# EasyEDA Pro project ProPrj_FurModularity 2_2025-12-27.epro, board PCB2_4
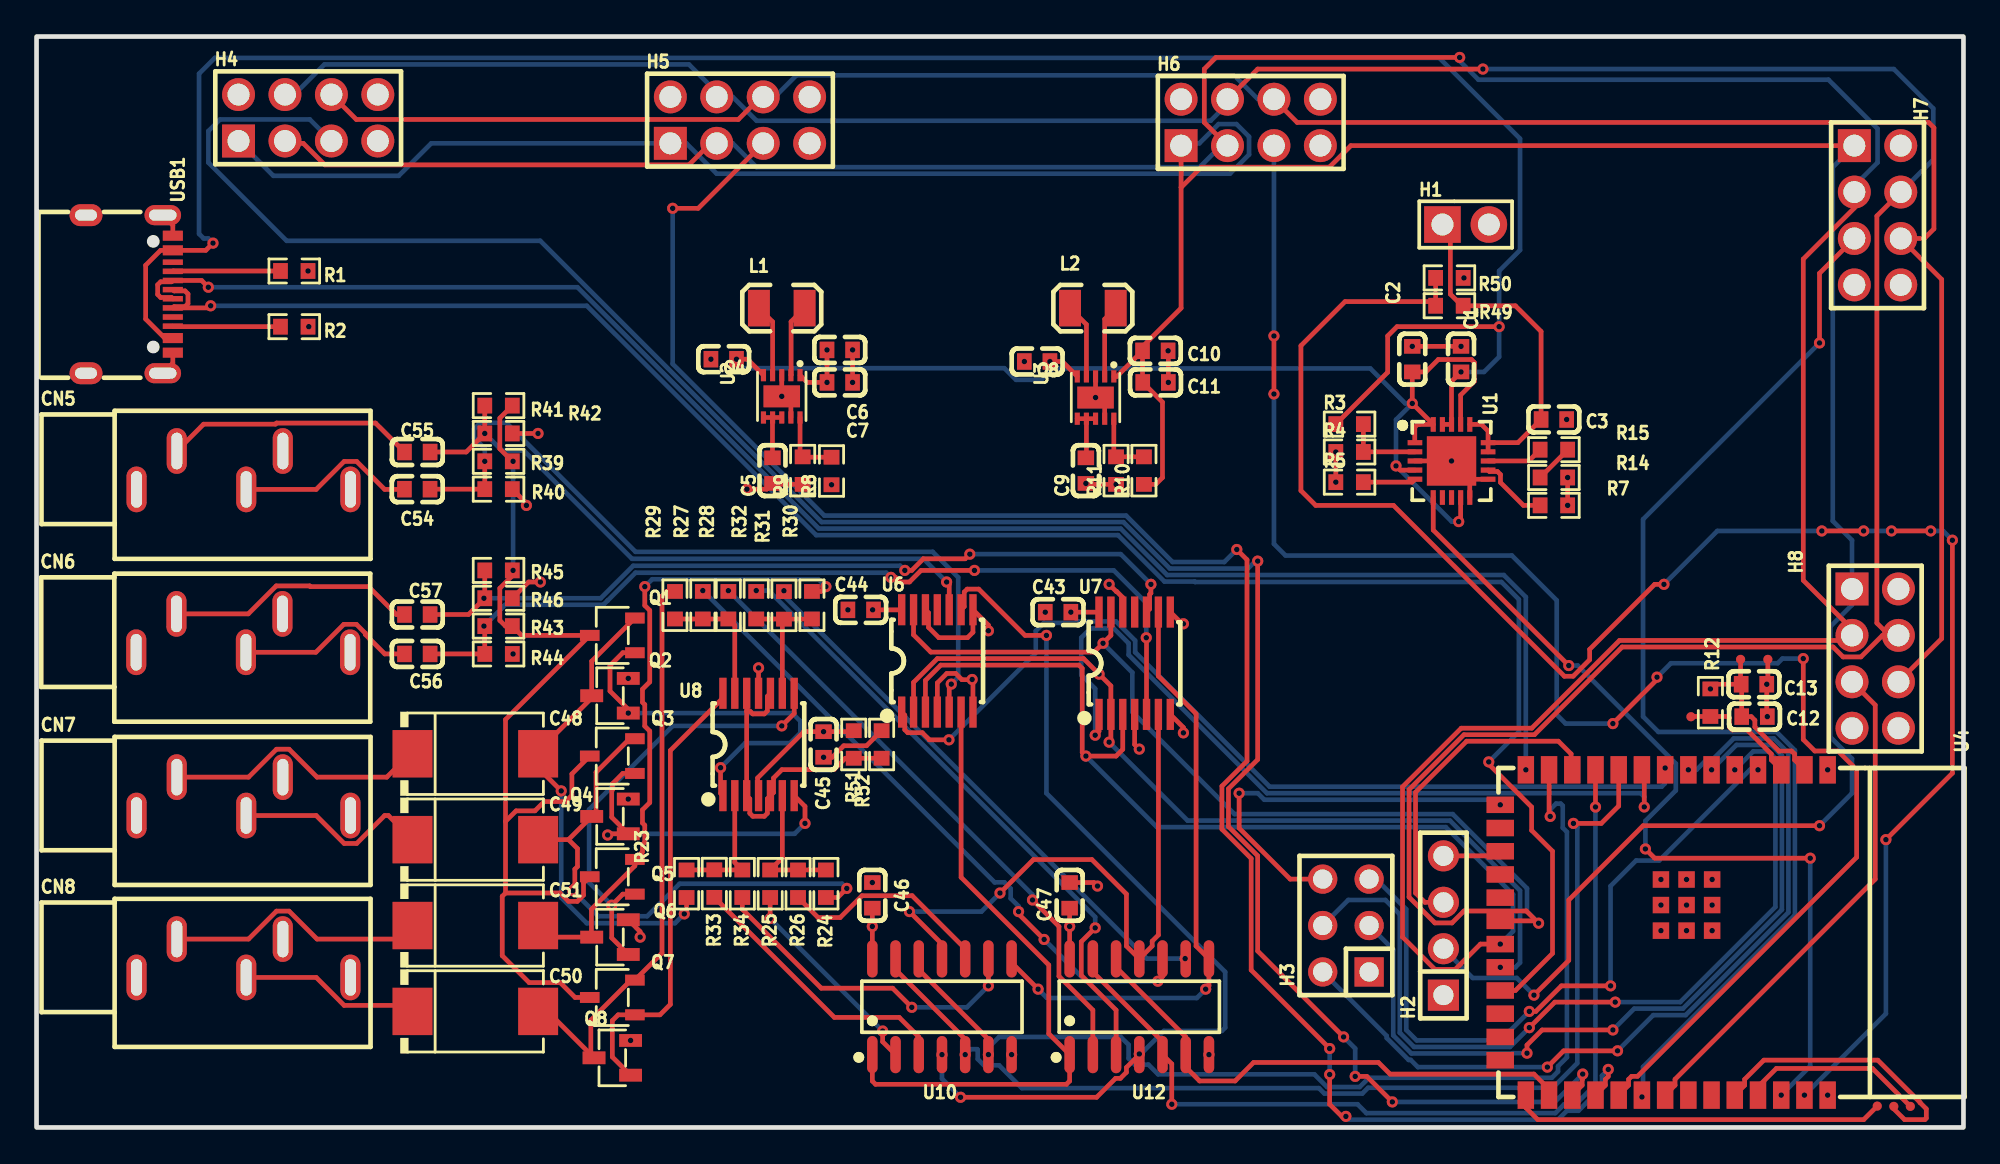
[diagram p7: board, top side]
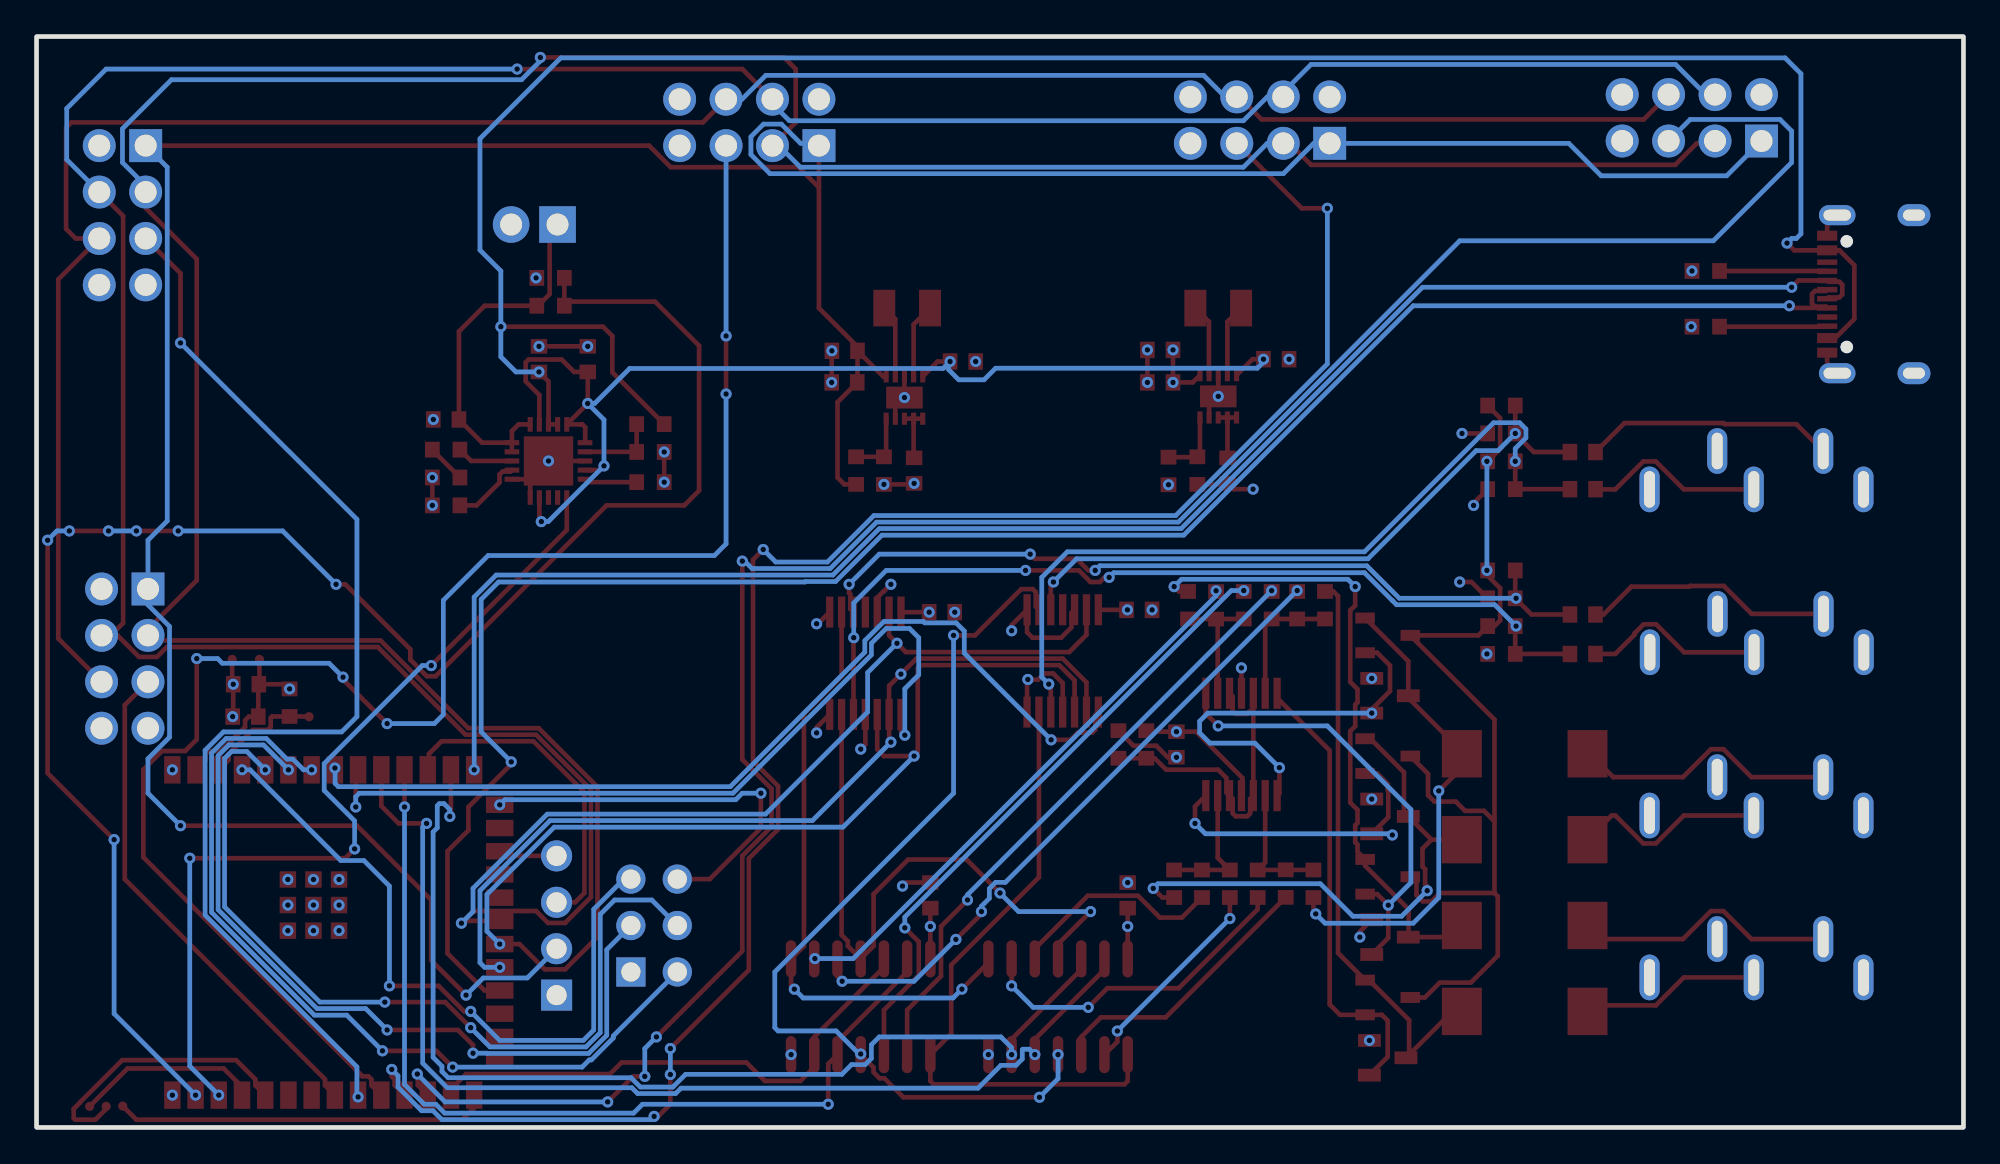
[diagram p8: board, bottom side, seen from below]

Outline 105.41 x 59.69 mm; copper layers: Top Layer, Inner1, Inner2, Bottom Layer. Coordinates in mm from the lower left corner of the outline.
Outline path: rectangle 0,59.69 105.41,0
Stack: Top Layer 0.035mm Outer layer thickness 1oz / Dielectric1 0.2104mm 7628 RC49% 8.6mil / Inner1 0.0152mm Inner layer thickness / Dielectric2 1.065mm 1.1mm H/HOZ Copper / Inner2 0.0152mm Inner layer thickness / Dielectric3 0.2104mm 7628 RC49% 8.6mil / Bottom Layer 0.035mm Outer layer thickness 1oz

## Design rules (mm)
template: JLCPCB Capability(Two Layers Board)
spacing copperThickness1oz (default): track to track 0.102, other pairs 0.152 to 0.3
spacing copperThickness2oz: track to track 0.203, other pairs 0.152 to 0.3
track width copperThickness1oz (default): min 0.127, default 0.254, max 2.54
track width copperThickness2oz: min 0.203, default 0.254, max 2.54
differential pair differentialPair (default): width min 0.127, default 0.254, max 2.54; gap min 0.152, default 0.152
via viaSize (default): diameter min 0.5, default 0.61, max 10; hole min 0.3, default 0.305, max 6.3

## Placement (name value [footprint] x y rotation side)
C1  10uF  [C0603]  77.93 42.04 270 top
C2  4.7uF  [C0603]  75.26 42.04 90 top
C3  4.7uF  [C0603]  83 38.74 0 top
C4  10uF  [C0603]  37.59 42.04 180 top
C5  100nF  [C0603]  40.26 35.94 270 top
C6  10uF  [C0603]  43.94 42.54 0 top
C7  10uF  [C0603]  43.94 40.77 0 top
C8  10uF  [C0603]  54.74 41.91 180 top
C9  100nF  [C0603]  57.4 35.94 270 top
C10  10uF  [C0603]  61.2 42.5 0 top
C11  10uF  [C0603]  61.21 40.77 0 top
C12  100nF  [C0603]  93.98 22.48 0 top
C13  100nF  [C0603]  93.95 24.25 0 top
C43  100nF  [C0603]  55.88 28.19 0 top
C44  100nF  [C0603]  45.09 28.32 0 top
C45  100nF  [C0603]  43.05 20.96 90 top
C46  10uF  [C0603]  45.72 12.7 90 top
C47  10uF  [C0603]  56.52 12.7 90 top
C48  470uF  [CAP-SMD_L7.3-W4.3-FD]  24 20.45 0 top
C49  470uF  [CAP-SMD_L7.3-W4.3-FD]  24 15.75 0 top
C50  470uF  [CAP-SMD_L7.3-W4.3-FD]  24 6.35 0 top
C51  470uF  [CAP-SMD_L7.3-W4.3-FD]  24 11.05 0 top
C54  10uF  [C0603]  20.83 34.93 180 top
C55  10uF  [C0603]  20.83 36.96 180 top
C56  10uF  [C0603]  20.83 25.91 180 top
C57  10uF  [C0603]  20.83 28.07 180 top
CN5  KH-PJ-325C  [AUDIO-TH_KH-PJ-325C]  11.32 35.96 0 top
CN6  KH-PJ-325C  [AUDIO-TH_KH-PJ-325C]  11.3 27.05 0 top
CN7  KH-PJ-325C  [AUDIO-TH_KH-PJ-325C]  11.32 18.12 0 top
CN8  KH-PJ-325C  [AUDIO-TH_KH-PJ-325C]  11.32 9.26 0 top
H1  PZ254V-11-02P  [HDR-TH_2P-P2.54-V-M]  78.18 49.41 0 top
H2  PZ254V-11-04P  [HDR-TH_4P-P2.54-V-M]  76.96 11.05 90 top
H3  2.54-2*3  [HDR-TH_6P-P2.54-V-R2-C3-S2.54_A2541WV-2X3P]  71.63 11.05 90 top
H4  A2541WV-2x4P  [HDR-TH_8P-P2.54-V-R2-C4-S2.54_A2541WV-2X4P]  14.86 55.25 0 top
H5  A2541WV-2x4P  [HDR-TH_8P-P2.54-V-R2-C4-S2.54_A2541WV-2X4P]  38.48 55.12 0 top
H6  A2541WV-2x4P  [HDR-TH_8P-P2.54-V-R2-C4-S2.54_A2541WV-2X4P]  66.42 54.99 0 top
H7  A2541WV-2x4P  [HDR-TH_8P-P2.54-V-R2-C4-S2.54_A2541WV-2X4P]  100.71 49.91 270 top
H8  A2541WV-2x4P  [HDR-TH_8P-P2.54-V-R2-C4-S2.54_A2541WV-2X4P]  100.58 25.65 270 top
L1  1.5uH  [L1207]  40.77 44.83 0 top
L2  1.5uH  [L1207]  57.78 44.83 0 top
Q1  MMBT2222A  [SOT-23-3_L2.9-W1.6-P1.90-LS2.8-BR]  31.5 26.92 0 top
Q2  MMBT2907A  [SOT-23-3_L2.9-W1.3-P1.90-LS2.4-BR]  31.37 23.62 0 top
Q3  MMBT2222A  [SOT-23-3_L2.9-W1.6-P1.90-LS2.8-BR]  31.5 20.32 0 top
Q4  MMBT2907A  [SOT-23-3_L2.9-W1.3-P1.90-LS2.4-BR]  31.37 17.02 0 top
Q5  MMBT2222A  [SOT-23-3_L2.9-W1.6-P1.90-LS2.8-BR]  31.5 13.72 0 top
Q6  MMBT2907A  [SOT-23-3_L2.9-W1.3-P1.90-LS2.4-BR]  31.37 10.41 0 top
Q7  MMBT2222A  [SOT-23-3_L2.9-W1.6-P1.90-LS2.8-BR]  31.5 7.11 0 top
Q8  MMBT2907A  [SOT-23-3_L2.9-W1.3-P1.90-LS2.4-BR]  31.5 3.81 0 top
R1  5.1kΩ  [R0603]  14.1 46.86 180 top
R2  5.1kΩ  [R0603]  14.1 43.82 180 top
R3  330kΩ  [R0603]  71.83 38.48 180 top
R4  110kΩ  [R0603]  71.83 36.96 0 top
R5  10kΩ  [R0603]  71.83 35.31 0 top
R7  100kΩ  [R0603]  83 34.04 180 top
R8  1.13MΩ  [R0603]  43.49 35.92 270 top
R9  200kΩ  [R0603]  41.91 35.94 90 top
R10  1.8MΩ  [R0603]  60.58 35.94 270 top
R11  200kΩ  [R0603]  59.05 35.94 90 top
R12  10kΩ  [R0603]  91.57 23.24 90 top
R14  1kΩ  [R0603]  83 35.56 180 top
R15  1kΩ  [R0603]  83 37.09 180 top
R23  1kΩ  [R0603]  35.56 13.34 270 top
R24  1kΩ  [R0603]  43.18 13.34 270 top
R25  1kΩ  [R0603]  40.13 13.34 90 top
R26  1kΩ  [R0603]  41.66 13.34 90 top
R27  1kΩ  [R0603]  36.45 28.58 270 top
R28  1kΩ  [R0603]  37.85 28.58 270 top
R29  1kΩ  [R0603]  34.92 28.58 90 top
R30  1kΩ  [R0603]  42.42 28.58 90 top
R31  1kΩ  [R0603]  40.89 28.57 270 top
R32  1kΩ  [R0603]  39.37 28.58 270 top
R33  1kΩ  [R0603]  37.08 13.34 90 top
R34  1kΩ  [R0603]  38.61 13.34 90 top
R39  10kΩ  [R0603]  25.27 36.45 0 top
R40  10kΩ  [R0603]  25.27 34.93 180 top
R41  10kΩ  [R0603]  25.27 39.5 0 top
R42  10kΩ  [R0603]  25.27 37.97 180 top
R43  10kΩ  [R0603]  25.27 27.43 0 top
R44  10kΩ  [R0603]  25.27 25.91 180 top
R45  10kΩ  [R0603]  25.27 30.48 0 top
R46  10kΩ  [R0603]  25.27 28.96 180 top
R49  1kΩ  [R0603]  77.29 44.96 0 top
R50  1kΩ  [R0603]  77.29 46.48 180 top
R51  1kΩ  [R0603]  44.7 20.96 90 top
R52  1kΩ  [R0603]  46.23 20.96 270 top
TP1  -  [Test-Point-0.5mm]  90.5 22.47 0 top
TP2  -  [Test-Point-0.5mm]  100.7 1.17 0 top
TP3  -  [Test-Point-0.5mm]  102.51 1.15 0 top
TP4  -  [Test-Point-0.5mm]  101.6 1.15 0 top
TP5  -  [Test-Point-0.5mm]  93.22 25.61 0 top
TP6  -  [Test-Point-0.5mm]  94.71 25.61 0 top
U1  MCP73871-2CAI/ML  [QFN-20_L4.0-W4.0-P0.50-BL-EP2.7]  77.41 36.47 270 top
U2  TPS63030DSKTG4  [SON-10_L2.5-W2.5-P0.50-TL-EP]  40.77 40 270 top
U3  TPS63030DSKTG4  [SON-10_L2.5-W2.5-P0.50-TL-EP]  57.93 39.94 270 top
U4  ESP32-S3-WROOM-1-N4  [WIFIM-SMD_ESP32-S3-WROOM-1-N8]  89.03 10.67 270 top
U6  MCP4261-103E/ST  [TSSOP-14_L5.0-W4.4-P0.65-LS6.4-BL]  49.28 25.53 0 top
U7  MCP4261-103E/ST  [TSSOP-14_L5.0-W4.4-P0.65-LS6.4-BL]  60.07 25.4 0 top
U8  LMV324IPWRE4  [TSSOP-14_L5.0-W4.4-P0.65-LS6.4-BL]  39.5 20.96 0 top
U10  74VHC4066M  [SOIC-14_L8.7-W3.9-P1.27-LS6.0-BL]  49.53 6.6 0 top
U12  74VHC4066M  [SOIC-14_L8.7-W3.9-P1.27-LS6.0-BL]  60.32 6.6 0 top
USB1  TYPE-C 16PIN 2MD(073)  [USB-C-SMD_TYPE-C-6PIN-2MD-073]  5.08 45.59 270 top

## Footprints (pads in the part's own frame, mm; a bottom-side part is the same pattern mirrored in y, then rotated)
AUDIO-TH_KH-PJ-325C
  oval 1.1x2.5 hole 0.6x2: 1(-5.85,-1.05) 2(0.15,-1.05) 3(2.15,1.05) 4(5.85,-1.05) 5(-3.65,1.05)
C0603
  rect 0.8x0.9 smd: 1(-0.7,0) 2(0.7,0)
CAP-SMD_L7.3-W4.3-FD
  rect 2.185x2.592 smd: 1(-3.437,0) 2(3.437,0)
HDR-TH_2P-P2.54-V-M
  rect 2x2 hole 1.2: 1(-1.27,0)
  round 2 hole 1.2: 2(1.27,0)
HDR-TH_4P-P2.54-V-M
  rect 1.7x1.7 hole 1.1: 1(-3.81,0)
  round 1.7 hole 1.1: 2(-1.27,0) 3(1.27,0) 4(3.81,0)
HDR-TH_6P-P2.54-V-R2-C3-S2.54_A2541WV-2X3P
  rect 1.6x1.6 hole 1.05: 1(-2.54,-1.27)
  round 1.6 hole 1.05: 2(-2.54,1.27) 3(0,-1.27) 4(0,1.27) 5(2.54,-1.27) 6(2.54,1.27)
HDR-TH_8P-P2.54-V-R2-C4-S2.54_A2541WV-2X4P
  rect 1.8x1.8 hole 1.2: 1(-3.81,-1.27)
  round 1.8 hole 1.2: 2(-3.81,1.27) 3(-1.27,-1.27) 4(-1.27,1.27) 5(1.27,-1.27) 6(1.27,1.27) 7(3.81,-1.27) 8(3.81,1.27)
L1207
  rect 1.2x2 smd: 1(-1.25,0) 2(1.25,0)
QFN-20_L4.0-W4.0-P0.50-BL-EP2.7
  rect 0.28x0.8 smd: 1(-1,-2) 2(-0.5,-2) 3(0,-2) 4(0.5,-2) 5(1,-2) 11(1,2) 12(0.5,2) 13(0,2) 14(-0.5,2) 15(-1,2)
  rect 0.8x0.28 smd: 6(2,-1) 7(2,-0.5) 8(2,0) 9(2,0.5) 10(2,1) 16(-2,1) 17(-2,0.5) 18(-2,0) 19(-2,-0.5) 20(-2,-1)
  rect 2.7x2.7 smd: 21(0,0)
R0603
  rect 0.806x0.864 smd: 1(-0.753,0) 2(0.753,0)
SOIC-14_L8.7-W3.9-P1.27-LS6.0-BL
  oval 0.574x2.038 smd: 1(-3.81,-2.619) 2(-2.54,-2.619) 3(-1.27,-2.619) 4(0,-2.619) 5(1.27,-2.619) 6(2.54,-2.619) 7(3.81,-2.619) 8(3.81,2.619) 9(2.54,2.619) 10(1.27,2.619) 11(0,2.619) 12(-1.27,2.619) 13(-2.54,2.619) 14(-3.81,2.619)
SON-10_L2.5-W2.5-P0.50-TL-EP
  rect 0.665x0.28 smd: 1(-1.157,1) 2(-1.157,0.5) 3(-1.157,0) 4(-1.157,-0.5) 5(-1.157,-1) 6(1.157,-1) 7(1.157,-0.5) 8(1.157,0) 9(1.157,0.5) 10(1.157,1)
  rect 1.2x2 smd: 11(0,0)
SOT-23-3_L2.9-W1.3-P1.90-LS2.4-BR
  rect 1.25x0.7 smd: 1(1,-0.95) 2(1,0.95) 3(-1,0)
SOT-23-3_L2.9-W1.6-P1.90-LS2.8-BR
  rect 1.07x0.6 smd: 1(1.235,-0.95) 2(1.235,0.95) 3(-1.235,0)
Test-Point-0.5mm
  round 0.5 smd: 1(0,0)
TSSOP-14_L5.0-W4.4-P0.65-LS6.4-BL
  rect 0.4x1.7 smd: 1(-1.95,-2.8) 2(-1.3,-2.8) 3(-0.65,-2.8) 4(0,-2.8) 5(0.65,-2.8) 6(1.3,-2.8) 7(1.95,-2.8) 8(1.95,2.8) 9(1.3,2.8) 10(0.65,2.8) 11(0,2.8) 12(-0.65,2.8) 13(-1.3,2.8) 14(-1.95,2.8)
USB-C-SMD_TYPE-C-6PIN-2MD-073
  rect 0.55x1.1 smd: 1(-3.2,2.375) 2(-2.4,2.375) 11(2.4,2.375) 12(3.2,2.375)
  rect 0.3x1.1 smd: 3(-1.75,2.375) 4(-1.25,2.375) 5(-0.75,2.375) 6(-0.25,2.375) 7(0.25,2.375) 8(0.75,2.375) 9(1.25,2.375) 10(1.75,2.375)
  oval 1.1x2 hole 0.6x1.5: 13(-4.325,1.825) 14(4.325,1.825)
  oval 1.2x1.8 hole 0.6x1.2: 13(-4.325,-2.375) 14(4.325,-2.375)
WIFIM-SMD_ESP32-S3-WROOM-1-N8
  rect 1.5x0.9 smd: 1(-8.9,8.954) 2(-8.9,7.684) 3(-8.9,6.415) 4(-8.9,5.144) 5(-8.9,3.874) 6(-8.9,2.604) 7(-8.9,1.335) 8(-8.9,0.065) 9(-8.9,-1.206) 10(-8.9,-2.475) 11(-8.9,-3.745) 12(-8.9,-5.016) 13(-8.9,-6.285) 14(-8.9,-7.556) 27(8.9,-7.556) 28(8.9,-6.285) 29(8.9,-5.016) 30(8.9,-3.745) 31(8.9,-2.475) 32(8.9,-1.206) 33(8.9,0.065) 34(8.9,1.335) 35(8.9,2.604) 36(8.9,3.874) 37(8.9,5.144) 38(8.9,6.415) 39(8.9,7.684) 40(8.9,8.954)
  rect 0.9x1.5 smd: 15(-6.985,-8.954) 16(-5.715,-8.954) 17(-4.445,-8.954) 18(-3.175,-8.954) 19(-1.905,-8.954) 20(-0.635,-8.954) 21(0.635,-8.954) 22(1.905,-8.954) 23(3.175,-8.954) 24(4.445,-8.954) 25(5.715,-8.954) 26(6.985,-8.954)
  rect 0.9x0.9 smd: 41(-2.9,2.635) 41(-2.9,1.235) 41(-2.9,-0.165) 41(-1.5,2.635) 41(-1.5,1.235) 41(-1.5,-0.165) 41(-0.1,2.635) 41(-0.1,1.235) 41(-0.1,-0.165)

## Nets
As in the schematic.

Pads without a net: CN5 3 4; CN6 3 4; CN7 3 4; CN8 3 4; U1 7 8; U4 16 18 19 24 25 26 34 35; U6 11; U7 11; USB1 3 9

## Via types
v1: diameter 0.61, hole 0.305, Top Layer to Bottom Layer, 191 vias

## Routing (per net, layer and track width the routed paths; a pad name or vN(x,y) marks a point on that pad's centre or on a via; arc(x,y) is an arc through that point)
3V3: length 85
  Top Layer w0.254: Q5.3 29.92,13.38 29.92,12.71 29.58,12.37 29.09,12.37 28.64,12.83 25.65,12.83 ; Q7.3 29.46,7.11 28.65,7.93 26.95,7.93 25.47,9.4 25.47,12.65 25.65,12.83 ; R45.2 26.03,30.19 25.34,29.5 25.34,27.74 25.65,27.43 R43.2 26.53,26.92 Q1.3 25.65,22.32 25.65,16.75 ; v1(91.57,23.99) 91.82,24.25 C13.1 ; 25.65,12.83 25.65,16.75 ; 25.65,16.75 26.23,17.32 27.26,17.32 27.77,17.83 28.94,17.83 29.29,18.17 29.29,19.34 Q3.3 ; 47.33,28.33 47.32,28.32 C44.2 ; U8.4 39.44,18.21 39.44,19.12 41.97,21.66 v1(43.05,21.66) 44.65,21.66 R51.2 ; C13.1 93.22,24.28 TP5.1 ; C13.1 93.28,24.22 C12.1 93.8,22.48 94,22.28 94,21.91 95.32,20.6 96.01,20.6 96.17,20.43 96.17,20.11 U4.2 ; v1(56.58,28.19) 58.12,28.19 U7.14 ; v1(43.24,42.54) v1(43.24,40.77) 42.16,40.77 U2.1 ; U10.14 v1(45.72,11) C46.1 ; R41.2 25.34,38.82 25.34,37.13 R39.2 ; C47.1 v1(56.52,11) U12.14
  Bottom Layer w0.254: v1(26.07,36.45) v1(26.07,30.48)
  vias: v1(43.49,35.17) v1(45.74,28.32)
5V: length 191.2
  Top Layer w0.254: C10.1 60.5,40.78 C11.1 61.59,39.69 61.59,35.56 61.22,35.19 R10.2 ; C10.1 60.5,42.72 62.61,44.83 62.61,51.44 ; C10.1 59.1,41.09 U3.1 ; H7.1 71.9,53.72 70.72,52.54 63.72,52.54 62.61,51.44 ; 62.61,51.44 H6.1 ; v1(97.54,16.51) 87.88,16.51 83.82,12.45 83.82,9.14 v1(81.91,7.24)
  Bottom Layer w0.254: H4.1 12.95,52.07 19.81,52.07 21.59,53.85 35.54,53.85 37.21,52.19 65.28,52.19 66.33,53.23 66.33,54.21 65.64,54.9 64.66,54.9 63.61,53.85 62.74,53.85 H6.1 ; H7.1 98.26,52.54 98.26,33.18 99.31,32.13 99.31,28.59 98.13,27.41 98.13,21.36 99.31,20.18 99.31,18.29 v1(97.54,16.51) ; H2.2 78.56,8.18 80.97,8.18 v1(81.91,7.24)
GND: length 63.2
  Top Layer w0.254: U1.10 78.41,35.47 v1(77.41,36.47) ; v1(75.26,42.74) v1(77.93,42.74) ; R9.1 40.31,35.19 C5.2 39.94,34.93 v1(38.86,34.93) ; 83.85,34.05 83.76,34.13 v1(83.76,35.56) ; v1(77.41,36.47) 78.1,36.47 78.36,36.21 78.36,35.56 78.45,35.47 U1.11 ; v1(77.41,36.47) U1.3 ; U6.7 51.23,24.47 v1(51.18,24.51) 51.17,24.5 50.62,24.5 50.28,24.84 49.8,24.84 49.28,24.32 U6.4 ; USB1.13 7.45,49.37 USB1.1 ; U6.12 48.8,28.16 48.8,27.36 49.36,26.8 50.93,26.8 51.23,27.1 U6.8 52.07,27.48 v1(52.07,27.18) ; U8.11 v1(39.5,25.15) ; USB1.14 7.45,41.82 USB1.12 ; v1(62.74,21.59) 62.74,21.88 U7.7 ; v1(33.02,10.41) 33.02,10.71 32.37,11.36 ; U7.8 62.66,27.56 v1(62.74,27.56) ; v1(61.91,40.77) 61.91,42.48 v1(61.9,42.5) ; U2.3 v1(40.77,40) 41.27,39.5 U2.9 ; U3.3 v1(57.93,39.94) 58.43,39.44 U3.9 ; U7.4 60.07,20.96 v1(60.32,20.7) ; v1(57.4,35.24) 57.46,35.19 v1(59.05,35.19) ; v1(58.67,29.72) 59.06,29.33 59.09,29.33 59.42,28.99 U7.12 ; v1(43.05,20.26) 43.53,20.26 44.16,20.88 45.4,20.88 R52.1 ; v1(71.08,36.96) v1(71.08,35.31) ; v1(58.04,13.21) 57.85,13.4 C47.2 ; TP6.1 94.71,24.31 v1(94.65,24.25) 94.65,22.51 v1(94.68,22.48) ; R40.1 26.8,34.15 v1(26.8,34.04) ; v1(27.56,29.84) 26.92,29.84 R46.1 ; v1(44.64,42.54) v1(44.64,40.77) ; R42.1 v1(27.43,37.97)
  vias: v1(14.85,46.86) v1(14.89,43.82) v1(26.07,25.91) v1(32.37,24.57) v1(32.37,17.97) v1(32.5,4.76) v1(36.89,42.04) v1(44.38,28.32) v1(45.72,13.4) v1(53.34,3.99) v1(54.04,41.91) v1(55.18,28.19) v1(64.13,3.99) v1(78.09,46.48) v1(83.71,38.74) v1(83.76,34.04) v1(88.86,13.57) v1(88.86,12.17) v1(88.86,10.77) v1(90.26,13.57) v1(90.26,12.17) v1(90.26,10.77) v1(91.66,13.57) v1(91.66,12.17) v1(91.66,10.77) v1(97.98,19.57) v1(97.98,1.77)
VBAT: length 20.3
  Top Layer w0.254: U1.15 U1.14 ; U1.15 81.03,37.47 C3.1 82.31,43.55 80.9,44.96 78.05,44.96 R49.2 77.98,44.96 77.34,45.59 77.34,48.97 H1.1 ; U1.15 79.41,38.1 79.04,38.47 U1.16
VBAT_SENSE: length 95.3
  Top Layer w0.254: v1(89.03,29.72) 88.52,29.72 84.96,26.16 84.96,25.59 84.06,24.69 83.58,24.69 74.23,34.04 69.98,34.04 69.17,34.85 69.17,42.77 71.58,45.19 76.31,45.19 R49.1 R50.2 ; v1(99.95,32.64) v1(97.66,32.64) ; v1(104.81,32.13) 104.81,19.39 v1(101.17,15.75) ; v1(103.62,32.64) v1(101.47,32.64)
  Bottom Layer w0.254: v1(96.71,1.77) 101.17,6.22 v1(101.17,15.75) ; v1(104.81,32.13) 104.3,32.64 v1(103.62,32.64) ; v1(97.66,32.64) 91.95,32.64 v1(89.03,29.72) ; v1(101.47,32.64) v1(99.95,32.64)
VBUS: length 124
  Top Layer w0.254: R3.2 73.91,41.32 73.91,43.31 74.42,43.82 v1(80.01,43.82) ; v1(77.93,41.34) 77.41,40.82 U1.18 U1.19 ; v1(9.65,48.39) 9.26,47.99 USB1.2 6.78,47.99 5.97,47.18 5.97,44.23 7.01,43.19 USB1.11
  Bottom Layer w0.254: v1(77.93,41.34) 79.19,41.34 80.01,42.16 v1(80.01,43.82) 80.01,46.86 81.15,48.01 81.15,54.1 76.73,58.52 9.75,58.52 8.89,57.66 8.89,48.9 9.14,48.64 9.4,48.64 v1(9.65,48.39)
CLK: length 124.1
  Top Layer w0.254: H4.6 17.49,55.15 38.39,55.15 39.62,56.39 H5.6 ; 101.85,24.38 104.22,26.75 104.22,46.4 H7.6 103.27,48.64 103.79,49.17 103.79,54.7 103.5,54.99 68.96,54.99 H6.6
  Bottom Layer w0.254: H5.6 40.39,56.39 41.56,57.57 65.51,57.57 66.82,56.26 H6.6
CS1: length 122.8
  Top Layer w0.254: v1(74.17,1.4) 72.77,2.79 v1(72.14,2.79) ; U4.29 84.55,2.31 84.55,2.63 84.58,2.66 v1(84.58,2.92) ; v1(66.8,30.99) 66.8,20.13 65.2,18.53 65.2,16.46 66.8,14.86 66.8,9.65 v1(71.5,4.95)
  Bottom Layer w0.254: v1(71.5,4.95) 72.14,4.32 v1(72.14,2.79) ; v1(74.17,1.4) 83.06,1.4 v1(84.58,2.92) ; H4.5 14.95,55.15 10.03,55.15 9.4,54.52 9.4,52.8 13.68,48.51 27.55,48.51 42.95,33.12 59.46,33.12 62,30.58 66.27,30.58 66.68,30.99 v1(66.8,30.99)
CS2: length 103
  Top Layer w0.254: v1(34.8,50.29) 36.19,50.29 39.75,53.85 ; v1(85.98,3.18) 85.98,2.79 85.82,2.63 85.82,2.31 U4.30 ; v1(71.63,0.61) 71.4,0.61 70.74,1.27 v1(70.74,2.9) ; v1(70.74,4.32) 66.45,8.61 66.45,14.72 64.85,16.32 64.85,18.68 66.22,20.05 66.22,31.06 v1(65.66,31.62)
  Bottom Layer w0.254: v1(65.66,31.62) 64.97,30.94 62.14,30.94 59.6,33.48 43.09,33.48 34.8,41.77 v1(34.8,50.29) ; v1(71.63,0.61) 71.81,0.43 83.23,0.43 83.72,0.91 84.35,0.91 85.64,2.2 85.64,2.83 v1(85.98,3.18) ; v1(70.74,4.32) v1(70.74,2.9)
CS3: length 91.5
  Top Layer w0.254: v1(86.23,22.1) 88.65,24.51 v1(88.65,24.64) ; v1(96.65,25.65) 96.65,21.23 97.28,20.6 98.55,20.6 99.57,19.58 99.57,14.78 87.58,2.8 87.26,2.8 87.09,2.63 87.09,2.31 U4.31 ; v1(67.69,43.31) v1(67.69,40.13)
  Bottom Layer w0.254: v1(86.23,22.1) 83.65,22.1 83.16,22.59 83.16,28.84 80.71,31.29 68.33,31.29 67.69,31.93 v1(67.69,40.13) ; v1(88.65,24.64) 89.41,25.4 95.25,25.4 95.5,25.65 v1(96.65,25.65) ; H6.5 v1(67.69,43.31)
CS4: length 62.5
  Top Layer w0.254: H7.5 97.54,46.74 v1(97.54,42.93)
  Bottom Layer w0.254: v1(97.54,42.93) 87.88,33.27 87.88,22.48 88.72,21.64 95.18,21.64 96.19,20.64 96.19,11.62 87.88,3.32 87.88,1.73 v1(87.82,1.67)
CS5: length 27.9
  Top Layer w0.254: 99.31,24.38 100.58,23.11 100.58,13.59 89.63,2.63 89.63,2.31 U4.33
CTRL_IN1_OUT1: length 60.5
  Top Layer w0.254: U4.10 86.55,17.59 85.6,16.64 v1(84.07,16.64) ; U10.13 46.99,8.64 50.8,4.83 v1(50.8,3.99)
  Bottom Layer w0.254: v1(84.07,16.64) 84.29,16.43 84.29,3.52 82.94,2.17 72.84,2.17 72.53,1.85 70.45,1.85 70.16,2.15 53.9,2.15 52.65,3.4 51.83,3.4 51.49,3.74 51.49,4.25 51.46,4.28 51.1,4.28 v1(50.8,3.99)
CTRL_IN1_OUT2: length 51
  Top Layer w0.254: U12.13 57.78,8.51 61.59,4.7 U12.5 62.1,3.48 v1(62.1,1.27) ; U4.11 v1(85.28,17.54)
  Bottom Layer w0.254: v1(62.1,1.27) 72.26,1.27 72.75,0.78 83.08,0.78 83.57,1.27 84.2,1.27 85.28,2.35 v1(85.28,17.54)
CTRL_IN2_OUT1: length 59.2
  Top Layer w0.254: v1(82.8,17.02) 82.74,17.08 U4.13 ; U10.12 48.26,8.64 52.07,4.83 v1(52.07,3.99)
  Bottom Layer w0.254: v1(52.07,3.99) 52.07,4.37 52.66,4.95 59.31,4.95 59.74,4.52 59.74,3.78 60.08,3.44 60.82,3.44 61.35,2.91 69.9,2.91 70.6,2.21 72.38,2.21 72.89,2.72 82.89,2.72 83.23,3.06 83.23,3.35 83.72,3.84 83.72,16.17 83.49,16.4 83.49,17.6 83.38,17.72 83.12,17.72 82.8,17.4 v1(82.8,17.02)
CTRL_IN2_OUT2: length 29
  Top Layer w0.254: U12.12 59.06,8.76 62.87,4.95 U12.6 62.87,3.3 63.62,2.54 65.57,2.54 66.58,3.56 73.41,3.56 74.04,2.92 81.91,2.92 82.74,2.09 U4.28
DOWN: length 46.6
  Top Layer w0.254: v1(86.36,6.86) 83.06,6.86 v1(81.66,5.46)
  Bottom Layer w0.254: v1(81.66,5.46) 80.61,4.41 75.35,4.41 74.57,5.19 74.57,11.66 73.79,12.45 71.75,12.45 H3.4 ; v1(86.36,6.86) 89.92,6.86 95.12,12.07 95.12,20.19 94.74,20.57 93.91,20.57 v1(92.9,19.57)
ENTER: length 22.2
  Top Layer w0.254: v1(65.79,18.29) 65.79,16.38 68.58,13.59 H3.6
  Bottom Layer w0.254: v1(80.07,17.65) 79.79,17.93 67.16,17.93 66.81,18.29 v1(65.79,18.29)
IJACK1_L: length 13.7
  Top Layer w0.254: CN5.5 9.14,38.48 13.07,38.48 13.13,38.54 18.54,38.54 C55.2
IJACK1_R: length 9.9
  Top Layer w0.254: 11.47,34.91 15.3,34.91 16.83,36.44 17.51,36.44 19.04,34.91 20.11,34.91 C54.2
IJACK2_L: length 13.8
  Top Layer w0.254: C57.2 19.69,28.07 18.16,29.59 14.98,29.59 14.94,29.63 13.11,29.63 11.58,28.1 CN6.5
IJACK2_R: length 10
  Top Layer w0.254: CN6.2 15.28,26 16.81,27.53 17.5,27.53 17.98,27.04 17.98,26.98 19.05,25.91 C56.2
IN1_L: length 35.1
  Top Layer w0.254: C55.1 23.5,36.96 v1(24.52,37.97) R41.1 ; 49.93,28.33 49.93,29.7 v1(49.78,29.84)
  Bottom Layer w0.254: v1(49.78,29.84) 48.51,31.12 32.58,31.12 26.66,37.03 25.46,37.03 v1(24.52,37.97)
IN1_L_SW1: length 15.3
  Top Layer w0.254: U10.3 48.26,4.95 47.19,6.02 43.64,6.02 R33.1
IN1_L_SW2: length 34.6
  Top Layer w0.254: v1(57.91,10.92) 57.15,10.16 57.15,8.33 59.06,6.42 U12.3
  Bottom Layer w0.254: v1(39.37,29.38) 40.05,29.38 57.91,11.51 v1(57.91,10.92)
IN1_POTOUT_L: length 51.1
  Top Layer w0.254: U12.4 59.62,3.28 59.62,3.02 59.29,2.69 59.03,2.69 57.99,1.65 v1(50.55,1.65) ; U6.9 50.75,28.5 50.75,29.29 50.91,29.46 51.54,29.46 54.07,26.92 v1(55.25,26.92)
  Bottom Layer w0.254: v1(50.55,1.65) 49.53,2.67 v1(49.53,3.99) ; v1(55.25,26.92) 55.25,18.29 65.02,8.51 65.02,5.46 64.84,5.28 61.67,5.28 60.32,3.94
  vias: v1(60.32,4.02)
IN1_POTOUT_R: length 35
  Top Layer w0.254: U6.6 50.58,13.69 55.37,8.89 55.37,5.13 U12.1 56.52,2.54 56.34,2.36 45.9,2.36 45.72,2.54 U10.1
IN1_R: length 44.2
  Top Layer w0.254: C54.1 R40.2 v1(24.52,36.45) ; 49.93,22.73 49.93,24.15 v1(50.04,24.26)
  Bottom Layer w0.254: v1(50.04,24.26) 50.42,24.64 50.42,30.1 49.02,31.5 32.77,31.5 25.7,38.56 24.28,38.56 23.94,38.22 23.94,37.73 24.52,37.15 v1(24.52,36.45)
IN1_R_SW1: length 11.4
  Top Layer w0.254: U10.2 46.29,4.69 v1(46.29,5.28) ; v1(40.13,11.43) R25.1
  Bottom Layer w0.254: v1(40.13,11.43) v1(46.29,5.28)
IN1_R_SW2: length 33.6
  Top Layer w0.254: U12.2 57.78,6.42 55.93,8.27 55.93,11 v1(54.48,12.45)
  Bottom Layer w0.254: v1(37.85,29.37) 54.48,12.73 v1(54.48,12.45)
IN2_L: length 44.9
  Top Layer w0.254: v1(47.5,30.48) 47.88,30.48 48.51,31.12 50.8,31.12 v1(51.05,31.37) ; C57.1 23.63,28.07 R46.2 R45.1 ; v1(60.96,29.72) 60.96,29.23 60.89,29.17 60.89,28.37 U7.10
  Bottom Layer w0.254: v1(51.05,31.37) 59.31,31.37 v1(60.96,29.72) ; v1(47.5,30.48) 47.24,30.73 32.64,30.73 30.86,28.96 v1(24.47,28.96)
IN2_L_SW1: length 18.3
  Top Layer w0.254: v1(47.88,6.57) 46.83,7.62 42.93,7.62 38.61,11.94 R34.1 ; v1(52.07,7.75) U10.9
  Bottom Layer w0.254: v1(47.88,6.57) 50.9,6.57 v1(52.07,7.75)
IN2_L_SW2: length 30.4
  Bottom Layer w0.254: v1(62.83,9.24) 60.74,9.24 40.89,29.09 v1(40.89,29.37)
IN2_POTOUT_L: length 33.7
  Top Layer w0.254: U7.9 61.37,24.69 63.43,22.63 63.43,9.93 U12.8 64.13,7.75 v1(63.96,7.57) ; U10.8 53.34,9.02 v1(54.79,7.57)
  Bottom Layer w0.254: v1(63.96,7.57) 63.47,7.08 55.27,7.08 v1(54.79,7.57)
IN2_POTOUT_R: length 34.8
  Top Layer w0.254: U7.6 61.37,10.53 61.03,10.19 61.03,9.93 U12.11 59.62,9.93 59.62,12.77 57.73,14.66 54.54,14.66 v1(52.71,12.83) ; U10.11 49.53,10.03 v1(47.75,11.81)
  Bottom Layer w0.254: v1(52.71,12.83) 51.69,11.81 v1(47.75,11.81)
IN2_R: length 49.3
  Top Layer w0.254: v1(46.74,30.1) 46.99,30.1 47.24,29.84 47.75,29.84 48.39,30.48 v1(51.31,30.48) ; U7.5 60.72,26.78 v1(60.71,26.8) ; R43.1 R44.2 C56.1
  Bottom Layer w0.254: v1(51.31,30.48) 58.93,30.48 60.71,28.7 v1(60.71,26.8) ; v1(46.74,30.1) 46.48,30.35 32.77,30.35 31.24,28.83 31.24,28.83 31.01,28.6 25.64,28.6 v1(24.47,27.43)
IN2_R_SW1: length 11.9
  Top Layer w0.254: R26.1 42.75,11.48 43.96,11.48 45.15,12.68 47.9,12.68 50.8,9.78 U10.10
IN2_R_SW2: length 35.6
  Top Layer w0.254: v1(53.72,11.81) 53.72,11.68 v1(55.12,10.29) ; U12.10 61.59,8.25 v1(61.34,8)
  Bottom Layer w0.254: v1(53.72,11.81) 53.72,12.1 53.29,12.54 53.29,13.07 52.95,13.41 52.41,13.41 v1(36.45,29.38) ; v1(55.12,10.29) 57.4,8 v1(61.34,8)
LEFT: length 46.4
  Top Layer w0.254: v1(86.49,4.19) 83.54,4.19 v1(82.65,3.3)
  Bottom Layer w0.254: v1(82.65,3.3) 75.56,3.3 75.17,3.69 75.06,3.69 73.86,4.89 73.86,5 H3.2 ; v1(90.36,19.57) 90.81,19.57 91.39,20.15 91.71,20.15 92.85,21.29 95.04,21.29 95.84,20.49 95.84,11.77 90.21,6.15 88.44,6.15 v1(86.49,4.19)
MISO: length 218.1
  Top Layer w0.254: H7.4 100.68,49.88 100.68,27.59 101.35,26.92 ; U7.13 58.77,26.92 v1(58.34,26.49) 57.86,26.01 48.92,26.01 47.98,26.95 U6.13 ; U4.20 82.04,11.3 ; 82.04,11.3 v1(82.17,11.18) ; 82.04,11.3 81.5,11.84 78.08,11.84 77.43,11.19 76.49,11.19 75.08,12.6 75.08,18.49 78.08,21.49 81.94,21.49 86.74,26.29 98.28,26.29 98.83,25.75 99.8,25.75 100.98,26.92 101.35,26.92 ; 101.35,26.92 H8.4 ; v1(79.12,57.91) 66.8,57.91 H6.4
  Bottom Layer w0.254: H4.4 14.1,56.52 15.75,58.17 35.69,58.17 37.21,56.64 H5.4 38.08,56.39 39.39,55.08 64.23,55.08 65.15,56.01 H6.4 ; v1(82.17,11.18) 81.53,11.81 81.53,13.08 77.47,17.15 65.53,17.15 59.94,22.73 59.94,24.89 v1(58.34,26.49) ; v1(79.12,57.91) 101.6,57.91 103.76,55.75 103.76,52.96 H7.4
MOSI: length 220
  Top Layer w0.254: H7.3 99.44,50.31 96.65,47.51 96.65,29.94 99.44,27.14 99.44,27.05 H8.3 99.03,26.65 86.59,26.65 81.79,21.85 77.94,21.85 74.73,18.64 74.73,10.42 76.49,8.65 77.61,8.65 78.99,10.03 v1(80.07,10.03) ; U6.3 48.63,24.46 49.46,25.3 57.02,25.3 57.2,25.12 57.2,20.52 v1(57.4,20.32) 59.06,20.32 59.42,20.69 U7.3 ; v1(77.85,58.55) 64.52,58.55 63.88,57.91 63.88,54.99 H6.3 ; H4.3 13.72,53.85 14.59,53.85 15.77,52.67 35.69,52.67 36.87,53.85 37.21,53.85
  Bottom Layer w0.254: 37.21,53.85 38.08,53.85 39.39,52.54 63.63,52.54 64.93,53.85 65.02,53.85 H6.3 ; H7.3 99.44,51.53 100.71,52.8 100.71,54.65 98.03,57.33 78.88,57.33 77.9,58.31 77.9,58.5 v1(77.85,58.55) ; v1(80.07,10.03) 80.77,10.73 80.77,12.75 77.09,16.43 61.29,16.43 v1(57.4,20.32)
OJACK1_L: length 14.6
  Top Layer w0.254: CN7.5 11.6,19.17 13.13,20.7 13.81,20.7 15.34,19.17 19.16,19.17 20.44,20.45
OJACK1_R: length 10.9
  Top Layer w0.254: 11.47,17.07 15.3,17.07 16.83,15.54 17.51,15.54 19.04,17.07 19.25,17.07 C49.1
OJACK2_L: length 14.5
  Top Layer w0.254: CN8.5 11.6,10.31 13.13,11.84 13.81,11.84 15.34,10.31 19.83,10.31 C51.1
OJACK2_R: length 9.9
  Top Layer w0.254: 11.47,8.21 15.3,8.21 16.83,6.68 20.24,6.68 C50.1
OUT1_L: length 26.5
  Top Layer w0.254: 27.31,20.45 30.37,23.5 Q2.3 30.37,25.51 Q1.2 ; v1(35.43,11.68) 35.56,11.81 R23.2 ; C48.2 27.44,19.68 v1(28.7,18.42)
  Bottom Layer w0.254: v1(35.43,11.68) 34.92,11.18 30.1,11.18 28.7,12.57 v1(28.7,18.42)
OUT1_R: length 29.7
  Top Layer w0.254: Q3.2 32.45,21.27 30.61,19.43 30.61,17.26 Q4.3 29.1,15.75 ; v1(29.34,12.95) 29.34,13.19 29.45,13.3 29.45,14.13 29.59,14.28 29.59,15.26 29.1,15.75 ; 29.1,15.75 C49.2 ; R24.2 43.82,12.58 v1(44.32,13.08)
  Bottom Layer w0.254: v1(29.34,12.95) 30.73,11.56 33.4,11.56 35.18,13.34 44.07,13.34 v1(44.32,13.08)
OUT2_L: length 35.4
  Top Layer w0.254: v1(43.18,29.59) 42.92,29.33 R30.2 ; v1(33.27,29.59) 33.27,28.56 33.55,28.29 33.55,24.38 33.15,23.98 33.15,23.26 33.27,23.14 33.27,21.96 33.55,21.69 33.55,17.77 33.15,17.38 33.15,16.66 33.27,16.53 33.27,15.6 33.15,15.48 33.15,15.08 Q5.2 32.73,14.32 30.35,11.94 30.35,10.43 Q6.3 28.07,10.41 C51.2
  Bottom Layer w0.254: v1(43.18,29.59) 42.77,30 33.68,30 v1(33.27,29.59)
OUT2_R: length 31.8
  Top Layer w0.254: 30.32,3.98 27.96,6.35 C50.2 ; 30.32,3.98 Q8.3 ; 30.32,3.98 30.32,5.87 32.51,8.06 32.73,8.06 34.21,9.55 34.21,29.07 34.47,29.33 R29.2
P1_CS: length 51.2
  Top Layer w0.254: 47.33,22.73 47.5,22.56 47.5,21.76 47.66,21.6 48.46,21.6 48.84,21.21 v1(49.91,21.21)
  Bottom Layer w0.254: v1(49.91,21.21) 54.66,25.96 54.66,27.17 55.1,27.61 56.82,27.61 56.9,27.69 59.05,27.69 60.1,26.64 60.1,26 67.46,18.64 88.9,18.64 89.08,18.82 89.08,19.56
  vias: v1(89.09,19.67)
P2_CS: length 44.7
  Top Layer w0.254: v1(57.91,21.46) 58.12,21.67 U7.1 ; U4.9 87.95,19.44 v1(87.95,17.54)
  Bottom Layer w0.254: v1(87.95,17.54) 87.95,18.1 87.76,18.29 67.31,18.29 59.74,25.86 59.74,26.49 58.93,27.31 57.66,27.31 57.15,26.8 57.15,24.77 57.91,24 v1(57.91,21.46)
REF_1V65: length 18.4
  Top Layer w0.254: U8.10 39.98,23.58 39.98,22.79 39.81,22.63 39.18,22.63 39.05,22.76 38.85,22.76 ; U8.12 38.85,22.76 ; 38.85,22.76 U8.3 39.02,17.98 39.02,17.19 39.18,17.03 39.81,17.03 39.98,17.19 39.98,17.98 U8.5 40.32,18.33 40.32,19.12 40.77,19.58 43.62,19.58 44.24,20.2 R51.1 R52.2
RIGHT: length 44.8
  Top Layer w0.254: v1(81.53,4.06) 81.53,4.51 82.36,5.33 v1(86.23,5.33)
  Bottom Layer w0.254: v1(86.23,5.33) 87.4,6.5 90.06,6.5 95.48,11.92 95.48,20.34 94.89,20.93 92.99,20.93 v1(91.63,19.57) ; v1(81.53,4.06) 80.77,4.06 80.75,4.05 75.21,4.05 74.22,5.04 74.22,9.73 72.9,11.05
SCK: length 47.7
  Top Layer w0.254: v1(58.67,21.08) 58.77,21.18 U7.2 58.77,24.16 v1(58.13,24.81) 57.28,25.65 49.28,25.65 47.98,24.35 U6.2
  Bottom Layer w0.254: v1(58.67,21.08) 62.97,16.79 77.32,16.79 81.15,12.96 81.15,9.02 80.9,8.76 v1(80.07,8.76)
SCL: length 3.2
  Top Layer w0.254: H2.4 79.82,14.86 U4.17
SDA: length 18.1
  Top Layer w0.254: H2.3 75.95,12.32 75.44,12.83 75.44,18.34 78.23,21.13 83.25,21.13 83.95,20.44 83.95,19.63 U4.12
UP: length 38.1
  Top Layer w0.254: v1(81.66,6.35) 82.02,6.35 83.42,7.75 v1(86.11,7.75)
  Bottom Layer w0.254: v1(81.66,6.35) 80.07,4.76 75.5,4.76 74.93,5.33 74.93,11.94 73.28,13.59 72.9,13.59 ; v1(86.11,7.75) 86.11,13.21 87.5,14.61 88.77,14.61 93.73,19.57 v1(94.17,19.57)
USB_DM: length 93
  Top Layer w0.254: v1(9.4,45.97) 9.03,46.34 USB1.5 7.38,46.27 6.79,46.27 6.63,46.11 6.63,45.58 6.79,45.41 7.38,45.41 USB1.7
  Bottom Layer w0.254: v1(81.47,19.57) 81.47,29.02 80.26,30.23 61.85,30.23 59.31,32.77 42.8,32.77 29.59,45.97 v1(9.4,45.97)
USB_DP: length 107.9
  Top Layer w0.254: USB1.6 7.53,45.77 8.12,45.77 8.28,45.61 8.28,45.08 8.12,44.91 7.53,44.91 USB1.8 9.41,44.84 v1(9.53,44.96) ; v1(79.44,20) 79.44,19.88 81.79,17.53 81.79,16.26 82.93,15.11 82.93,9.53 80.9,7.49 U4.23
  Bottom Layer w0.254: v1(79.44,20) 81.09,21.65 81.09,28.89 80.14,29.84 63.37,29.84 63.35,29.87 61.7,29.87 59.16,32.41 42.65,32.41 30.1,44.96 v1(9.53,44.96)
USB_SENSE: length 48.6
  Top Layer w0.254: v1(97.03,14.73) 88.52,14.73 v1(88.01,15.24) ; U1.6 76.41,32.69 v1(83.82,25.27)
  Bottom Layer w0.254: v1(95.44,1.77) 97.03,3.35 v1(97.03,14.73) ; v1(88.01,15.24) 88.01,16.77 89.68,18.44 89.68,19.91 84.31,25.27 v1(83.82,25.27)
VSYS: length 66.5
  Top Layer w0.254: U1.9 77.91,33.26 v1(77.8,33.15) ; U1.17 77.91,40.08 78.65,40.82 78.65,41.86 78.49,42.02 76.68,42.02 76,41.34 C2.1 v1(75.26,39.62) U1.20 75.66,38.47 75.65,38.48 75.56,38.48 75.4,38.31 75.4,37.48 U1.1 ; U1.4 74.6,35.97 v1(74.37,36.2) ; v1(38.29,42.04) 38.89,42.04 U2.5 ; U3.5 56.12,41.91 v1(55.44,41.91)
  Bottom Layer w0.254: v1(77.8,33.15) 77.42,33.15 v1(74.37,36.2) 74.37,38.73 v1(75.26,39.62) 74.88,39.62 72.96,41.53 55.82,41.53 55.52,41.83 ; 55.52,41.83 55.52,41.47 54.96,40.91 53.58,40.91 52.94,41.54 38.63,41.54 38.37,41.8 38.37,41.95 v1(38.29,42.04) ; 55.52,41.83 v1(55.44,41.91)
$1N480: length 5.9
  Top Layer w0.254: USB1.4 7.47,46.86 R1.2
$1N506: length 5.9
  Top Layer w0.254: R2.2 7.48,43.82 USB1.10
$1N1632: length 4.4
  Top Layer w0.254: U1.2 72.59,36.97 72.58,36.96 72.58,38.48
$1N1764: length 2.9
  Top Layer w0.254: 72.58,35.31 75.25,35.31 U1.5
$1N1839: length 3.1
  Top Layer w0.254: U1.13 81.63,36.47 R15.2
$1N1881: length 3.9
  Top Layer w0.254: U1.12 79.49,35.89 79.92,35.89 80.08,35.72 80.08,35.29 81.33,34.04 R7.2
$1N2370: length 3.2
  Top Layer w0.254: U2.7 U2.6 ; U2.7 U2.8 ; U2.7 40.26,38.84 40.26,36.64
$1N2432: length 4
  Top Layer w0.254: U2.2 41.28,41.17 41.28,44.09 L1.2
$1N2438: length 4
  Top Layer w0.254: U2.4 40.27,44.08 L1.1
$1N2461: length 3.8
  Top Layer w0.254: R8.1 41.93,36.67 R9.2 41.77,36.84 U2.10
$1N3033: length 3.7
  Top Layer w0.254: R10.1 R11.2 58.93,36.82 U3.10
$1N3038: length 4
  Top Layer w0.254: U3.2 58.43,44.23 L2.2
$1N3051: length 3.2
  Top Layer w0.254: U3.7 U3.8 ; U3.7 57.43,36.67 57.4,36.64 ; U3.7 U3.6
$1N3063: length 4.1
  Top Layer w0.254: L2.1 57.43,43.93 U3.4
$1N4175: length 2.1
  Top Layer w0.254: R14.2 83.76,37.07 83.76,37.09
$2N491: length 20.5
  Top Layer w0.254: U4.27 81.47,1.08 82.12,0.43 99.95,0.43 TP2.1
$2N495: length 6.6
  Top Layer w0.254: U4.3 94.9,20.11 94.9,20.43 93.58,21.75 92.76,21.75 92.6,21.91 92.6,22.41 92.52,22.49 R12.1 90.5,22.49 TP1.1
$2N518: length 10.1
  Top Layer w0.254: U4.37 94.17,2.22 95.18,3.23 100.43,3.23 TP3.1
$2N539: length 15.3
  Top Layer w0.254: TP4.1 101.6,1.02 102.19,0.43 103.3,0.43 103.38,0.51 103.38,1.02 103.03,1.36 103.03,1.37 100.72,3.68 94.49,3.68 93.44,2.63 93.44,2.31 U4.36
$3N1138: length 7.3
  Top Layer w0.254: R23.1 R34.2 38.2,14.5 U8.2
$3N1139: length 7.4
  Top Layer w0.254: U8.6 40.8,14.75 R25.2 R26.2 R24.1
$3N1144: length 7.1
  Top Layer w0.254: R29.1 R27.2 R28.2 38.2,27.47 U8.13
$3N1145: length 7.1
  Top Layer w0.254: R32.2 40.73,27.82 ; 40.73,27.82 R30.1 ; 40.73,27.82 40.8,27.75 U8.9
$3N1256: length 24.8
  Top Layer w0.254: Q5.1 32.07,12.77 v1(31.47,12.16) 31.47,10.37 32.37,9.46 ; v1(40.77,21.97) 41.45,22.65 U8.8
  Bottom Layer w0.254: v1(31.47,12.16) 30.23,13.4 30.23,17.4 34.8,21.97 v1(40.77,21.97)
$3N2308: length 21.6
  Top Layer w0.254: U8.1 37.42,18.28 v1(37.42,19.69) ; Q1.1 32.07,25.97 31.37,25.27 31.37,23.88 32.37,22.88 v1(32.37,22.67)
  Bottom Layer w0.254: v1(37.42,19.69) 38.76,21.03 41.22,21.03 41.78,21.59 41.78,22.23 41.34,22.67 v1(32.37,22.67)
$3N2351: length 18.6
  Top Layer w0.254: v1(31.24,16) 31.31,16.07 Q4.1 31.47,16.97 31.47,18.43 31.5,18.46 31.5,18.8 32.07,19.37 Q3.1 ; v1(42.04,16.64) 42.04,17.57 U8.7
  Bottom Layer w0.254: v1(31.24,16) 31.31,16.07 41.47,16.07 v1(42.04,16.64)
$3N2603: length 25.2
  Top Layer w0.254: U8.14 37.55,23.5 34.67,20.62 34.67,6.73 34.1,6.16 Q7.1 31.82,6.16 31.5,5.84 31.5,3.86 Q8.1

## Copper pours and planes (outline as drawn; the poured copper is in the pictures)
3V3 on Inner2: -6.6,64.64 113.16,64.64 113.16,-6.1 -6.6,-6.1
GND on Inner1: -2.54,61.85 108.84,61.85 108.84,-3.81 -2.54,-3.81
